# Altium schematic sheet Back-end.SchDoc
size A4
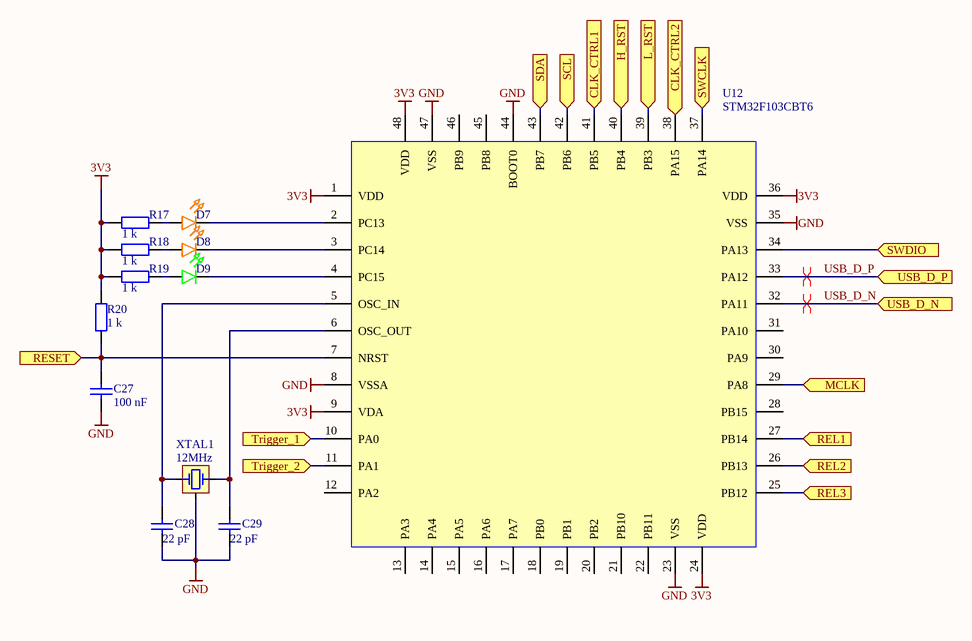
[diagram p0: Back-end.SchDoc]

## Parts
C27  100 nF  [C1206]
C28  22 pF  [C1206]
C29  22 pF  [C1206]
D7  LED Orange  [LED Diod red]  (value not drawn)
D8  LED Orange  [LED Diod red]  (value not drawn)
D9  *  [LED Diod grean]  (value not drawn)
R17  1 k  [R1206]
R18  1 k  [R1206]
R19  1 k  [R1206]
R20  1 k  [R1206]
U12  STM32F103CBT6  [LQFP48_L]
XTAL1  Value1: 12MHz  [XTAL 2.5MM X3.2MM]  (hidden comment: 7M-12.000MAAJ-T)

## Ports
CLK_CTRL1, CLK_CTRL2, H_RST, L_RST, MCLK, REL1, REL2, REL3, RESET, SCL, SDA, SWCLK, SWDIO, Trigger_1, Trigger_2, USB_D_N, USB_D_P

## Nets
3V3: R17.2 R18.2 R19.2 R20.2 U12.1(VDD) U12.9(VDA) U12.24(VDD) U12.36(VDD) U12.48(VDD)
GND: C27.1 C28.2 C29.2 U12.8(VSSA) U12.23(VSS) U12.35(VSS) U12.44(BOOT0) U12.47(VSS) XTAL1.2
CLK_CTRL1: U12.41(PB5) ; port CLK_CTRL1
CLK_CTRL2: U12.38(PA15) ; port CLK_CTRL2
H_RST: U12.40(PB4) ; port H_RST
L_RST: U12.39(PB3) ; port L_RST
MCLK: U12.29(PA8) ; port MCLK
REL1: U12.27(PB14) ; port REL1
REL2: U12.26(PB13) ; port REL2
REL3: U12.25(PB12) ; port REL3
RESET: C27.2 R20.1 U12.7(NRST) ; port RESET
SCL: U12.42(PB6) ; port SCL
SDA: U12.43(PB7) ; port SDA
SWCLK: U12.37(PA14) ; port SWCLK
SWDIO: U12.34(PA13) ; port SWDIO
Trigger_1: U12.10(PA0) ; port Trigger_1
Trigger_2: U12.11(PA1) ; port Trigger_2
USB_D_N: U12.32(PA11) ; port USB_D_N
USB_D_P: U12.33(PA12) ; port USB_D_P
NetC28_1: C28.1 U12.5(OSC_IN) XTAL1.1(OSC1)
NetC29_1: C29.1 U12.6(OSC_OUT) XTAL1.3(OSC2)
NetD7_1: D7.1 R17.1
NetD7_2: D7.2 U12.2(PC13)
NetD8_1: D8.1 R18.1
NetD8_2: D8.2 U12.3(PC14)
NetD9_1: D9.1 R19.1
NetD9_2: D9.2 U12.4(PC15)

Not connected (* = marked no-connect by the designer): U12 12(PA2) 13(PA3) 14(PA4) 15(PA5) 16(PA6) 17(PA7) 18(PB0) 19(PB1) 20(PB2) 21(PB10) 22(PB11) 28(PB15) 30(PA9) 31(PA10) 45(PB8) 46(PB9)

## Layout directives
differential pair: USB_D_N, USB_D_P

## Library data of the parts
C27 = Cap Semi: Capacitor (Semiconductor SIM Model); Value: 100n; Published: 8-Jun-2000; LatestRevisionDate: 29-May-2009; LatestRevisionNote: IPC-7351 Footprint Added.; PackageReference: C1206; Publisher: Altium Limited; PackageDescription: Chip Capacitor
C28 C29 = Cap Semi: Capacitor (Semiconductor SIM Model); Published: 8-Jun-2000; LatestRevisionDate: 29-May-2009; LatestRevisionNote: IPC-7351 Footprint Added.; PackageReference: C1206; Publisher: Altium Limited; PackageDescription: r0805; Value: 22 pF
D7 D8 = LED SMD Diod Orange
D9 = LED SMD Diod Green: Assembly: SMD; ComponentLink1URL: *; ComponentLink2URL: *; ComponentLink1Description: Datasheet; ComponentLink2Description: *; Tolerance1: *; Value1: *; Manufacture: *; Shop1: *; Shop1ID: *; ComponentType: Diod LED; DafaultFootprint: *; Replacement: *; Value2: *; Parameter1: *; Parameter2: *; ComponentSymbol: *; Tolerance2: *
R17-R20 = Res2: Resistor; Value: 1K; Published: 8-Jun-2000; LatestRevisionDate: 17-Jul-2002; LatestRevisionNote: Re-released for DXP Platform.; PackageReference: AXIAL-0.4; Publisher: Altium Limited; PackageDescription: Axial Device, Thru-Hole; 2 Leads; 0.4 in Pin Spacing
U12 = STM32F070CxTxx
XTAL1 = XTAL 12MHz: TXC  7M-12.000MAAJ-T  CRYSTAL, 12MHZ, 18PF, 3.2 X 2.5MM; Tolerance1: 18ppm; Value1: Farnell; Shop1ID: 2413996; DafaultFootprint: SMD XTAL 3.2mm x 2.5mm; Assembly: SMD; Parameter1: Freq; ComponentLink1URL: http://www.farnell.com/datasheets/1796637.pdf?_ga=1.82791254.1104608453.1473079731; ComponentLink2URL: *; ComponentLink1Description: Datasheet; ComponentLink2Description: *; Manufacture: TXC; ComponentType: Oscillator Quartz; Replacement: *; ComponentSymbol: 7M-12.000MAAJ-T